# Altium schematic sheet Э3-4 TDR Делитель.SchDoc
size 594 x 420 mm; Address1: Address1; Address2: Address2; Address3: Address3; Address4: Address4; DocumentNumber: АБВГ.123456.001 Э3; SheetNumber: 5; SheetTotal: 7; Scale: 1:1; DocumentType: Схема электрическая принципиальная; FirstReferrence: АБВГ.123456.001
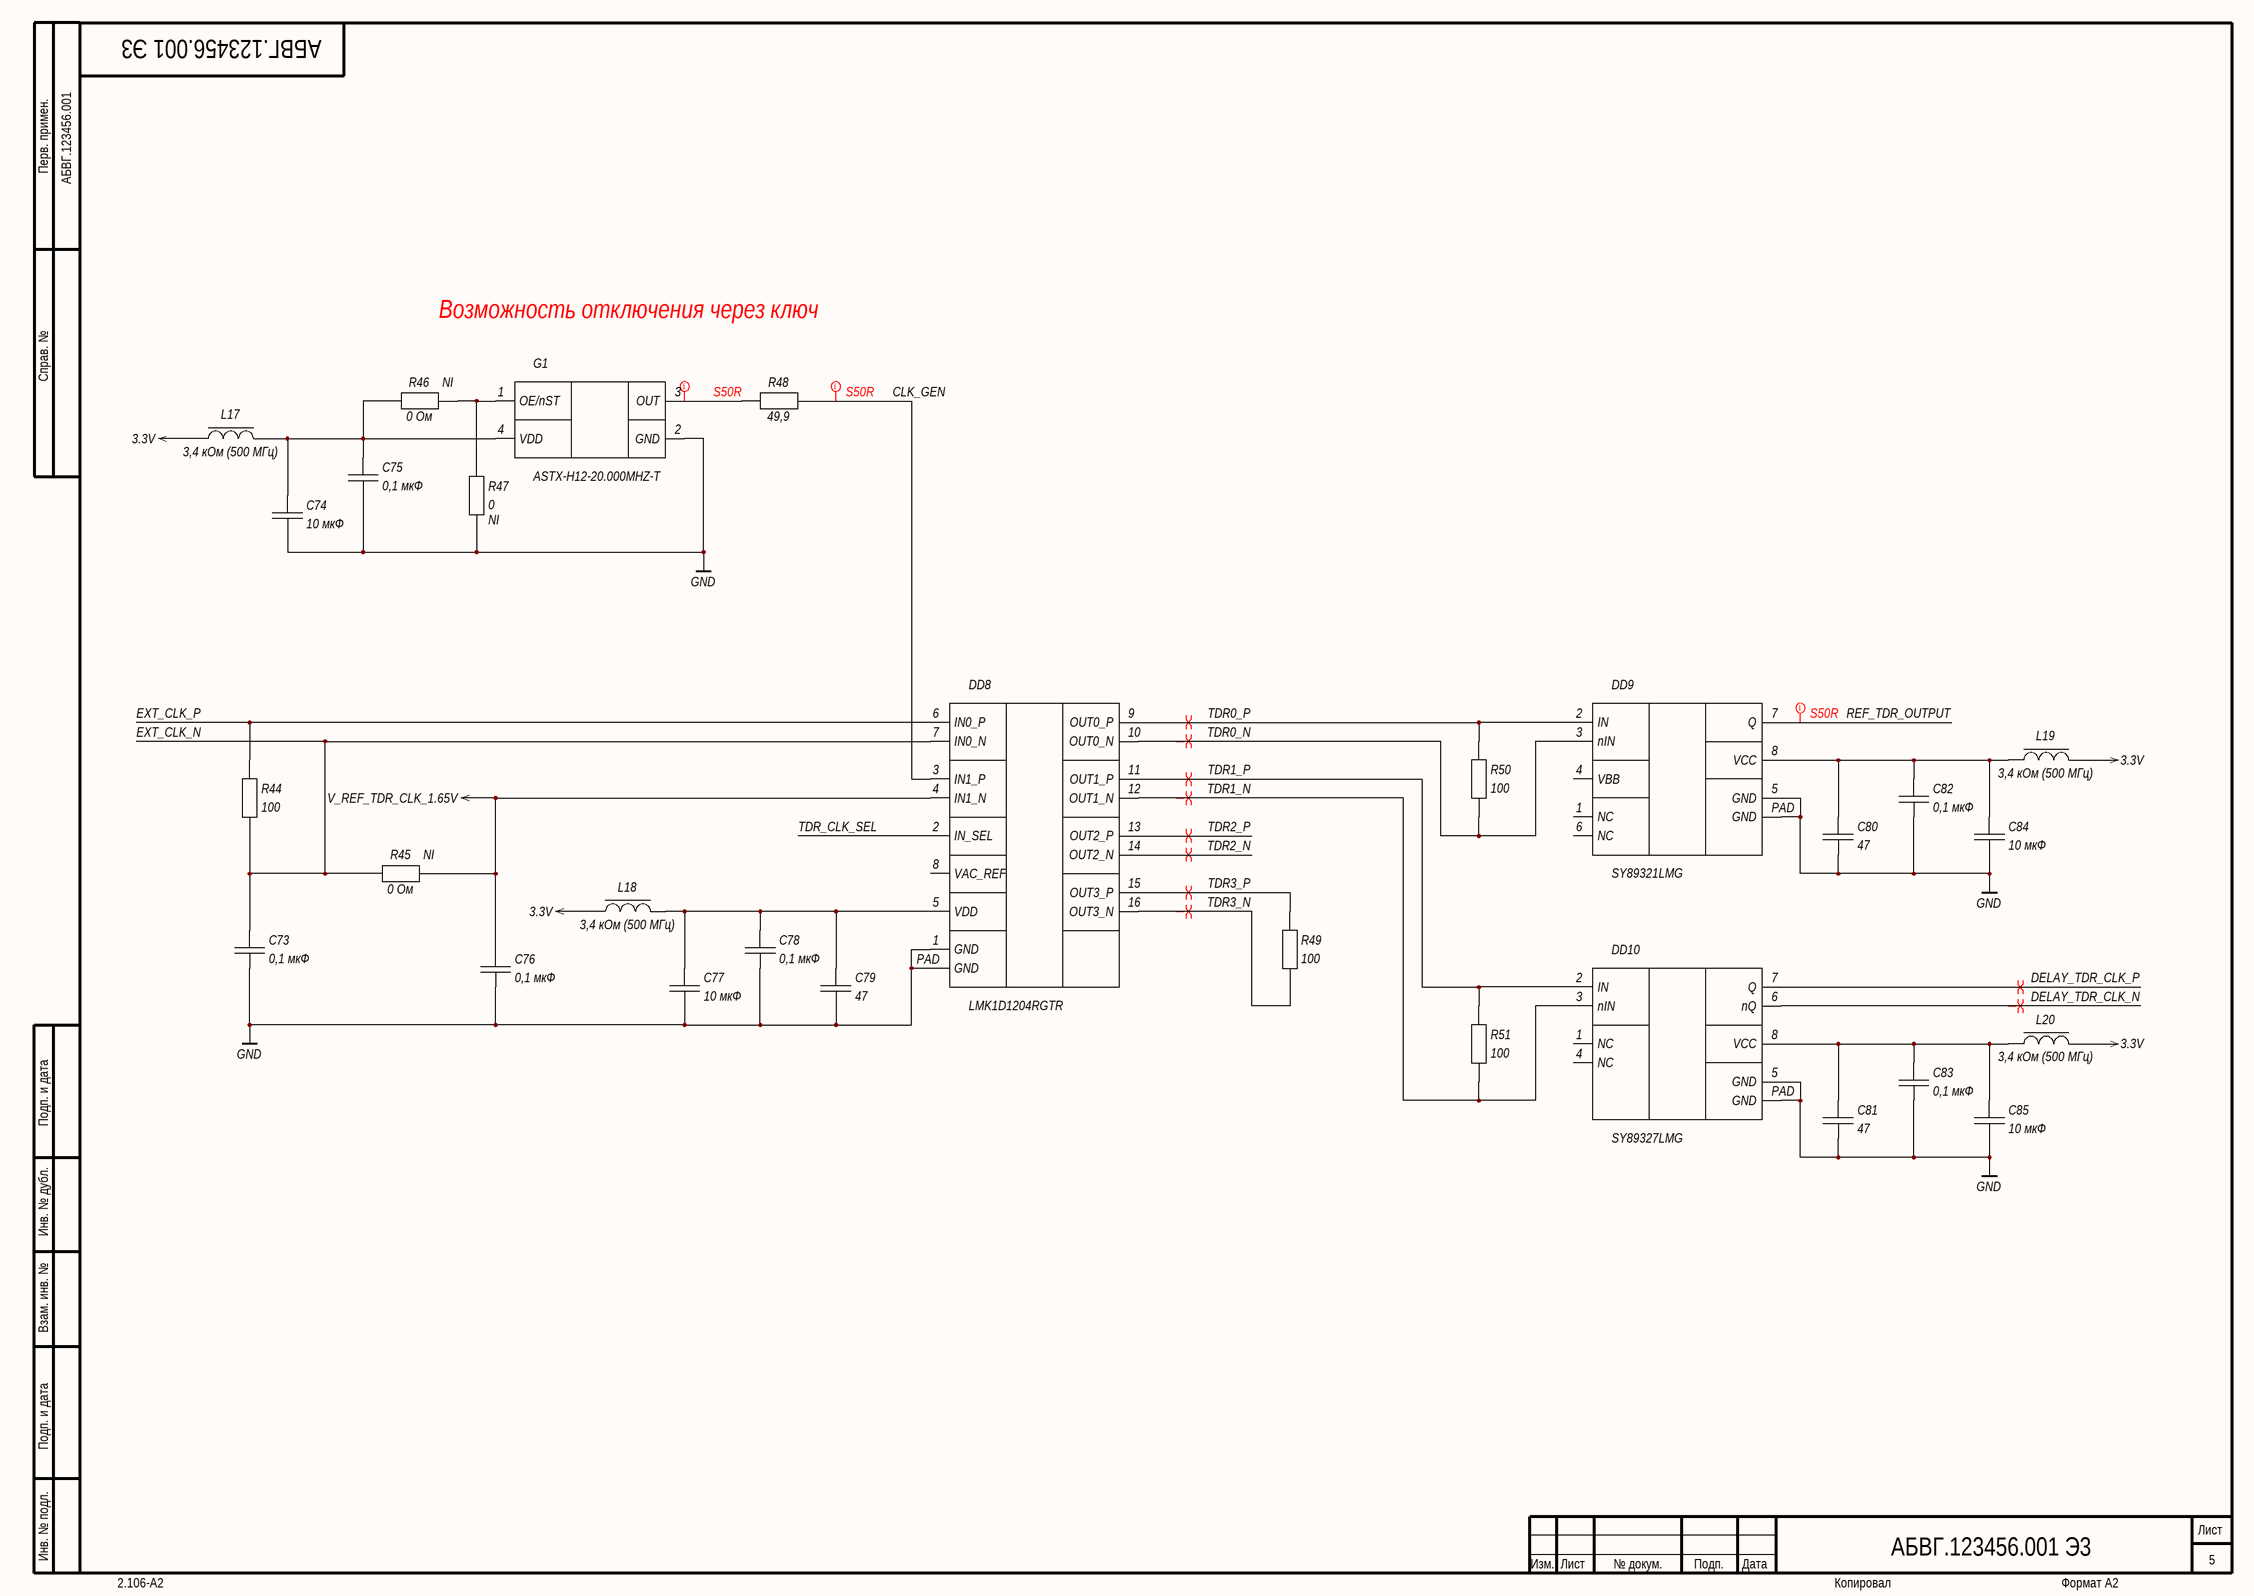
[diagram p0: Э3-4 TDR Делитель.SchDoc]

## Parts
C73  value 0,1 мкФ  [C0402-B-0.5mm]
C74  value 10 мкФ  [C0603-B-0.8mm]
C75  value 0,1 мкФ  [C0402-B-0.5mm]
C76  value 0,1 мкФ  [C0402-B-0.5mm]
C77  value 10 мкФ  [C0603-B-0.8mm]
C78  value 0,1 мкФ  [C0402-B-0.5mm]
C79  value 47  [C0402-B-0.5mm]
C80  value 47  [C0402-B-0.5mm]
C81  value 47  [C0402-B-0.5mm]
C82  value 0,1 мкФ  [C0402-B-0.5mm]
C83  value 0,1 мкФ  [C0402-B-0.5mm]
C84  value 10 мкФ  [C0603-B-0.8mm]
C85  value 10 мкФ  [C0603-B-0.8mm]
DD8  LMK1D1204RGTR  [16-QFN-3-H1-EP1.7]
DD9  SY89321LMG  [8-MLF]
DD10  SY89327LMG  [8-MLF]
G1  ASTX-H12-20.000MHZ-T  [ASTX-H12]
L17  value 3,4 кОм (500 МГц)  [L0402-B-0.5mm]
L18  value 3,4 кОм (500 МГц)  [L0402-B-0.5mm]
L19  value 3,4 кОм (500 МГц)  [L0402-B-0.5mm]
L20  value 3,4 кОм (500 МГц)  [L0402-B-0.5mm]
R44  value 100  [CR0402-B-0.35mm]
R45  value 0 Ом  ComponentType: NI  [CR0402-B-0.35mm]
R46  value 0 Ом  ComponentType: NI  [CR0402-B-0.35mm]
R47  value 0  ComponentType: NI  [CR0402-B-0.35mm]
R48  value 49,9  [CR0402-B-0.35mm]
R49  value 100  [CR0402-B-0.35mm]
R50  value 100  [CR0402-B-0.35mm]
R51  value 100  [CR0402-B-0.35mm]

## Nets
3.3V: L17.1 L18.1 L19.2 L20.2
GND: C73.2 C74.2 C75.2 C76.2 C77.2 C78.2 C79.2 C80.2 C81.2 C82.2 C83.2 C84.2 C85.2 DD8.1(GND) DD8.PAD(GND) DD9.5(GND) DD9.PAD(GND) DD10.5(GND) DD10.PAD(GND) G1.2(GND) R47.2
V_REF_TDR_CLK_1.65V: C76.1 DD8.4(IN1_N) R45.2
CLK_GEN: DD8.3(IN1_P) R48.2
DELAY_TDR_CLK_N: DD10.6(nQ)
DELAY_TDR_CLK_P: DD10.7(Q)
EXT_CLK_N: C73.1 DD8.7(IN0_N) R44.2 R45.1
EXT_CLK_P: DD8.6(IN0_P) R44.1
REF_TDR_OUTPUT: DD9.7(Q)
TDR0_N: DD8.10(OUT0_N) DD9.3(nIN) R50.2
TDR0_P: DD8.9(OUT0_P) DD9.2(IN) R50.1
TDR1_N: DD8.12(OUT1_N) DD10.3(nIN) R51.2
TDR1_P: DD8.11(OUT1_P) DD10.2(IN) R51.1
TDR2_N: DD8.14(OUT2_N)
TDR2_P: DD8.13(OUT2_P)
TDR3_N: DD8.16(OUT3_N) R49.2
TDR3_P: DD8.15(OUT3_P) R49.1
TDR_CLK_SEL: DD8.2(IN_SEL)
NetC74_1: C74.1 C75.1 G1.4(VDD) L17.2 R46.1
NetC77_1: C77.1 C78.1 C79.1 DD8.5(VDD) L18.2
NetC80_1: C80.1 C82.1 C84.1 DD9.8(VCC) L19.1
NetC81_1: C81.1 C83.1 C85.1 DD10.8(VCC) L20.1
NetG1_1: G1.1(OE/nST) R46.2 R47.1
NetG1_3: G1.3(OUT) R48.1

Not connected (* = marked no-connect by the designer): DD8 8(VAC_REF); DD9 1(NC) 4(VBB) 6(NC); DD10 1(NC) 4(NC)

## Layout directives
differential pair: DELAY_TDR_CLK_N, DELAY_TDR_CLK_P, TDR0_N, TDR0_P, TDR1_N, TDR1_P, TDR2_N, TDR2_P, TDR3_N, TDR3_P
net class S50R: CLK_GEN, NetG1_3, REF_TDR_OUTPUT

## Notes on the sheet
- Возможность отключения через ключ
- Перв. примен.
- Справ. №
- Подп. и дата
- Инв. № дубл.
- Взам. инв. №
- Инв. № подл.
- Изм.
- Лист
- № докум.
- Подп.
- Дата
- 2.106-A2
- Копировал
- Формат А2

## Library data of the parts
C73 C75 C76 C78 C82 C83 = Non Polar Ver.: 0402 X7R 0,1 мкФ ±10 % 50 В; PartNumber: GRM155R71H104KE14D; TemperatureRange: -XX...+XX°C; VoltageRating: 50 В; Manufacturer: *; Package: *; HelpURL: *; Tolerance: *; TypeDielectric: *; ESR: *; ComponentType: CAP
C74 C77 C84 C85 = Non Polar Ver.: 0603 X5R 10 мкФ ±20 % 25 В; PartNumber: GRM188R61E106MA73; TemperatureRange: -XX...+XX°C; VoltageRating: 25 В; Manufacturer: *; Package: *; HelpURL: *; Tolerance: *; TypeDielectric: *; ESR: *; ComponentType: CAP
C79-C81 = Non Polar Ver.: 0402 NP0 47 пФ ±5 % 50 В; PartNumber: GCM1555C1H470JA16; TemperatureRange: -XX...+XX°C; VoltageRating: 50 В; Manufacturer: *; Package: *; HelpURL: *; Tolerance: *; TypeDielectric: *; ESR: *; ComponentType: CAP
DD8 = LMK1D1204: Low Additive Jitter LVDS Buffer; Manufacturer: Texas Instruments, Inc.; TemperatureRange: -40...+85°C; Package: 16-VQFN; PartNumber: LMK1D1204RGTR; ComponentType: IC; DatasheetURL: *; HelpURL: *; PinCount: 16
DD9 = SY89321L: 3.3V DIFFERENTIAL LVPECL/CML/LVDS-to-LVTTL TRANSLATOR; Manufacturer: Microchip Technology; TemperatureRange: -40...+85°C; Package: 8-MLF; PartNumber: SY89321LMG; ComponentType: IC; DatasheetURL: *; HelpURL: *; PinCount: 8
DD10 = SY89327L: 3.3V 2.5Gbps ANY INPUT-to-LVPECL DIFFERENTIAL TRANSLATOR; Manufacturer: Microchip Technology; TemperatureRange: -40...+85°C; Package: 8-QFN; PartNumber: SY89327LMG; ComponentType: IC; DatasheetURL: *; HelpURL: *; PinCount: 8
G1 = Generator: TemperatureRange: -...+°C; Tolerance: ± ppm; PartNumber: ASTX-H12-20.000MHZ-T; Manufacturer: *; HelpURL: *; ComponentType: GEN; DatasheetURL: *; Package: *; PinCount: 4; Frequency: *; LoadCapacitance: *
L17-L20 = Inductor MC Hor.: PartNumber: BLM15HD182BH1; TemperatureRange: -XX...+XX°C; Manufacturer: *; Package: *; HelpURL: *; MaxCurrent: *; ComponentType: IND; DatasheetURL: *; PinCount: 2
R44 R49-R51 = Resistor Ver.: 0402 100 Ом ±1 %; TemperatureRange: -XX...+XX°C; Manufacturer: *; PartNumber: *; Package: *; HelpURL: *; PowerRating: *; DatasheetURL: *; Tolerance: *; ComponentType: RES
R45 R46 = Resistor Hor.: 0402 0 Ом; TemperatureRange: -XX...+XX°C; Manufacturer: *; PartNumber: *; Package: *; HelpURL: *; PowerRating: *; Tolerance: *; DatasheetURL: *
R47 = Resistor Ver.: 0402 0 Ом; TemperatureRange: -XX...+XX°C; Manufacturer: *; PartNumber: *; Package: *; HelpURL: *; PowerRating: *; DatasheetURL: *; Tolerance: *
R48 = Resistor Hor.: 0402 49,9 Ом ±1 %; TemperatureRange: -XX...+XX°C; Manufacturer: *; PartNumber: *; Package: *; HelpURL: *; PowerRating: *; Tolerance: *; DatasheetURL: *; ComponentType: RES